# Altium schematic sheet Э3-4.SchDoc
size 594 x 420 mm; Address1: Address1; Address2: Address2; Address3: Address3; Address4: Address4; SheetNumber: 4; SheetTotal: 12; DocumentType: Схема электрическая принципиальная
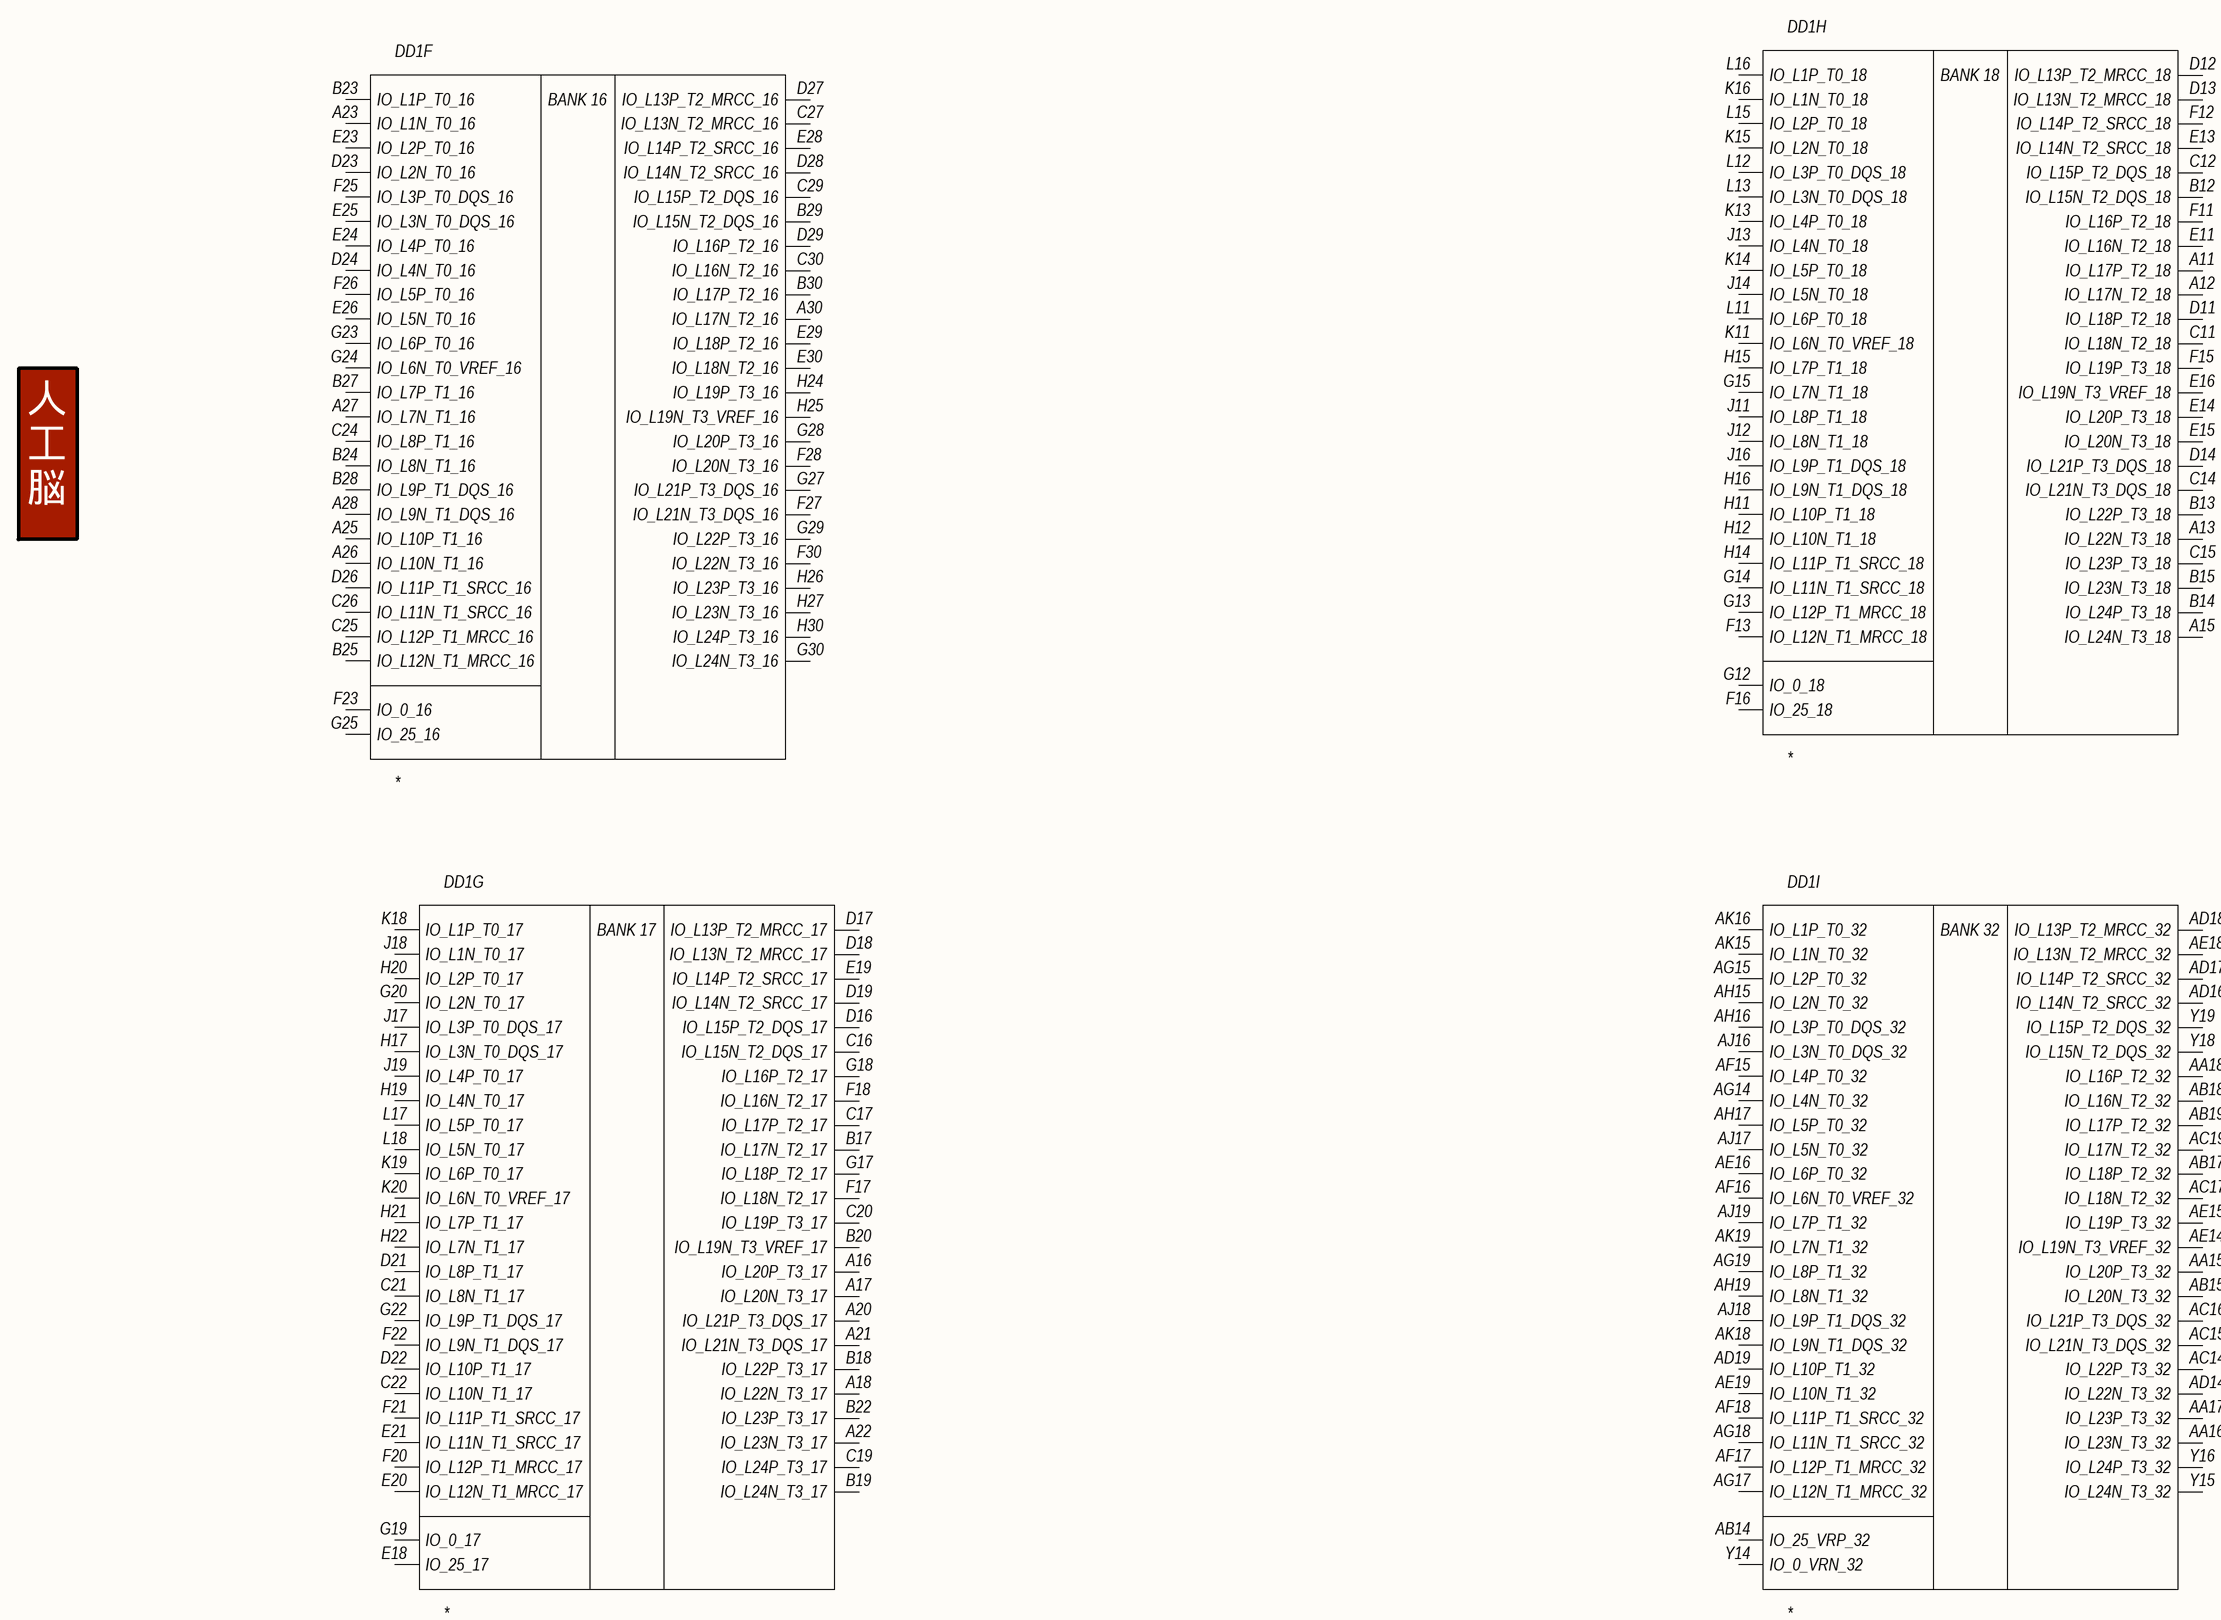
[diagram p0: Э3-4.SchDoc]

## Parts
DD1  *  [FF900/FFG900]  (value not drawn)  (parts F,G,H,I of 19)

## Nets

Not connected (* = marked no-connect by the designer): DD1 A11(IO_L17P_T2_18) A12(IO_L17N_T2_18) A13(IO_L22N_T3_18) A15(IO_L24N_T3_18) A16(IO_L20P_T3_17) A17(IO_L20N_T3_17) A18(IO_L22N_T3_17) A20(IO_L21P_T3_DQS_17) A21(IO_L21N_T3_DQS_17) A22(IO_L23N_T3_17) A23(IO_L1N_T0_16) A25(IO_L10P_T1_16) A26(IO_L10N_T1_16) A27(IO_L7N_T1_16) A28(IO_L9N_T1_DQS_16) A30(IO_L17N_T2_16) AA15(IO_L20P_T3_32) AA16(IO_L23N_T3_32) AA17(IO_L23P_T3_32) AA18(IO_L16P_T2_32) AB14(IO_25_VRP_32) AB15(IO_L20N_T3_32) AB17(IO_L18P_T2_32) AB18(IO_L16N_T2_32) AB19(IO_L17P_T2_32) AC14(IO_L22P_T3_32) AC15(IO_L21N_T3_DQS_32) AC16(IO_L21P_T3_DQS_32) AC17(IO_L18N_T2_32) AC19(IO_L17N_T2_32) AD14(IO_L22N_T3_32) AD16(IO_L14N_T2_SRCC_32) AD17(IO_L14P_T2_SRCC_32) AD18(IO_L13P_T2_MRCC_32) AD19(IO_L10P_T1_32) AE14(IO_L19N_T3_VREF_32) AE15(IO_L19P_T3_32) AE16(IO_L6P_T0_32) AE18(IO_L13N_T2_MRCC_32) AE19(IO_L10N_T1_32) AF15(IO_L4P_T0_32) AF16(IO_L6N_T0_VREF_32) AF17(IO_L12P_T1_MRCC_32) AF18(IO_L11P_T1_SRCC_32) AG14(IO_L4N_T0_32) AG15(IO_L2P_T0_32) AG17(IO_L12N_T1_MRCC_32) AG18(IO_L11N_T1_SRCC_32) AG19(IO_L8P_T1_32) AH15(IO_L2N_T0_32) AH16(IO_L3P_T0_DQS_32) AH17(IO_L5P_T0_32) AH19(IO_L8N_T1_32) AJ16(IO_L3N_T0_DQS_32) AJ17(IO_L5N_T0_32) AJ18(IO_L9P_T1_DQS_32) AJ19(IO_L7P_T1_32) AK15(IO_L1N_T0_32) AK16(IO_L1P_T0_32) AK18(IO_L9N_T1_DQS_32) AK19(IO_L7N_T1_32) B12(IO_L15N_T2_DQS_18) B13(IO_L22P_T3_18) B14(IO_L24P_T3_18) B15(IO_L23N_T3_18) B17(IO_L17N_T2_17) B18(IO_L22P_T3_17) B19(IO_L24N_T3_17) B20(IO_L19N_T3_VREF_17) B22(IO_L23P_T3_17) B23(IO_L1P_T0_16) B24(IO_L8N_T1_16) B25(IO_L12N_T1_MRCC_16) B27(IO_L7P_T1_16) B28(IO_L9P_T1_DQS_16) B29(IO_L15N_T2_DQS_16) B30(IO_L17P_T2_16) C11(IO_L18N_T2_18) C12(IO_L15P_T2_DQS_18) C14(IO_L21N_T3_DQS_18) C15(IO_L23P_T3_18) C16(IO_L15N_T2_DQS_17) C17(IO_L17P_T2_17) C19(IO_L24P_T3_17) C20(IO_L19P_T3_17) C21(IO_L8N_T1_17) C22(IO_L10N_T1_17) C24(IO_L8P_T1_16) C25(IO_L12P_T1_MRCC_16) C26(IO_L11N_T1_SRCC_16) C27(IO_L13N_T2_MRCC_16) C29(IO_L15P_T2_DQS_16) C30(IO_L16N_T2_16) D11(IO_L18P_T2_18) D12(IO_L13P_T2_MRCC_18) D13(IO_L13N_T2_MRCC_18) D14(IO_L21P_T3_DQS_18) D16(IO_L15P_T2_DQS_17) D17(IO_L13P_T2_MRCC_17) D18(IO_L13N_T2_MRCC_17) D19(IO_L14N_T2_SRCC_17) D21(IO_L8P_T1_17) D22(IO_L10P_T1_17) D23(IO_L2N_T0_16) D24(IO_L4N_T0_16) D26(IO_L11P_T1_SRCC_16) D27(IO_L13P_T2_MRCC_16) D28(IO_L14N_T2_SRCC_16) D29(IO_L16P_T2_16) E11(IO_L16N_T2_18) E13(IO_L14N_T2_SRCC_18) E14(IO_L20P_T3_18) E15(IO_L20N_T3_18) E16(IO_L19N_T3_VREF_18) E18(IO_25_17) E19(IO_L14P_T2_SRCC_17) E20(IO_L12N_T1_MRCC_17) E21(IO_L11N_T1_SRCC_17) E23(IO_L2P_T0_16) E24(IO_L4P_T0_16) E25(IO_L3N_T0_DQS_16) E26(IO_L5N_T0_16) E28(IO_L14P_T2_SRCC_16) E29(IO_L18P_T2_16) E30(IO_L18N_T2_16) F11(IO_L16P_T2_18) F12(IO_L14P_T2_SRCC_18) F13(IO_L12N_T1_MRCC_18) F15(IO_L19P_T3_18) F16(IO_25_18) F17(IO_L18N_T2_17) F18(IO_L16N_T2_17) F20(IO_L12P_T1_MRCC_17) F21(IO_L11P_T1_SRCC_17) F22(IO_L9N_T1_DQS_17) F23(IO_0_16) F25(IO_L3P_T0_DQS_16) F26(IO_L5P_T0_16) F27(IO_L21N_T3_DQS_16) F28(IO_L20N_T3_16) F30(IO_L22N_T3_16) G12(IO_0_18) G13(IO_L12P_T1_MRCC_18) G14(IO_L11N_T1_SRCC_18) G15(IO_L7N_T1_18) G17(IO_L18P_T2_17) G18(IO_L16P_T2_17) G19(IO_0_17) G20(IO_L2N_T0_17) G22(IO_L9P_T1_DQS_17) G23(IO_L6P_T0_16) G24(IO_L6N_T0_VREF_16) G25(IO_25_16) G27(IO_L21P_T3_DQS_16) G28(IO_L20P_T3_16) G29(IO_L22P_T3_16) G30(IO_L24N_T3_16) H11(IO_L10P_T1_18) H12(IO_L10N_T1_18) H14(IO_L11P_T1_SRCC_18) H15(IO_L7P_T1_18) H16(IO_L9N_T1_DQS_18) H17(IO_L3N_T0_DQS_17) H19(IO_L4N_T0_17) H20(IO_L2P_T0_17) H21(IO_L7P_T1_17) H22(IO_L7N_T1_17) H24(IO_L19P_T3_16) H25(IO_L19N_T3_VREF_16) H26(IO_L23P_T3_16) H27(IO_L23N_T3_16) H30(IO_L24P_T3_16) J11(IO_L8P_T1_18) J12(IO_L8N_T1_18) J13(IO_L4N_T0_18) J14(IO_L5N_T0_18) J16(IO_L9P_T1_DQS_18) J17(IO_L3P_T0_DQS_17) J18(IO_L1N_T0_17) J19(IO_L4P_T0_17) K11(IO_L6N_T0_VREF_18) K13(IO_L4P_T0_18) K14(IO_L5P_T0_18) K15(IO_L2N_T0_18) K16(IO_L1N_T0_18) K18(IO_L1P_T0_17) K19(IO_L6P_T0_17) K20(IO_L6N_T0_VREF_17) L11(IO_L6P_T0_18) L12(IO_L3P_T0_DQS_18) L13(IO_L3N_T0_DQS_18) L15(IO_L2P_T0_18) L16(IO_L1P_T0_18) L17(IO_L5P_T0_17) L18(IO_L5N_T0_17) Y14(IO_0_VRN_32) Y15(IO_L24N_T3_32) Y16(IO_L24P_T3_32) Y18(IO_L15N_T2_DQS_32) Y19(IO_L15P_T2_DQS_32)

## Notes on the sheet
- 人
  工
  脳
- Перв. примен.
- Справ. №
- Подп. и дата
- Инв. № дубл.
- Взам. инв. №
- Инв. № подл.
- Изм.
- Лист
- № докум.
- Подп.
- Дата
- 2.106-A2
- Копировал
- Формат А2
- (in symbol XC7K325T-XFFG900, part F) BANK 16
- (in symbol XC7K325T-XFFG900, part G) BANK 17
- (in symbol XC7K325T-XFFG900, part H) BANK 18
- (in symbol XC7K325T-XFFG900, part I) BANK 32

## Library data of the parts
DD1 = XC7K325T-XFFG900: Kintex-7 FPGA; Manufacturer: Xilinx Inc.; TemperatureRange: -XX...+XX°C; Package: 900-FFG; ComponentType: IC; DatasheetURL: *; HelpURL: *; PinCount: 900; PartNumber: *